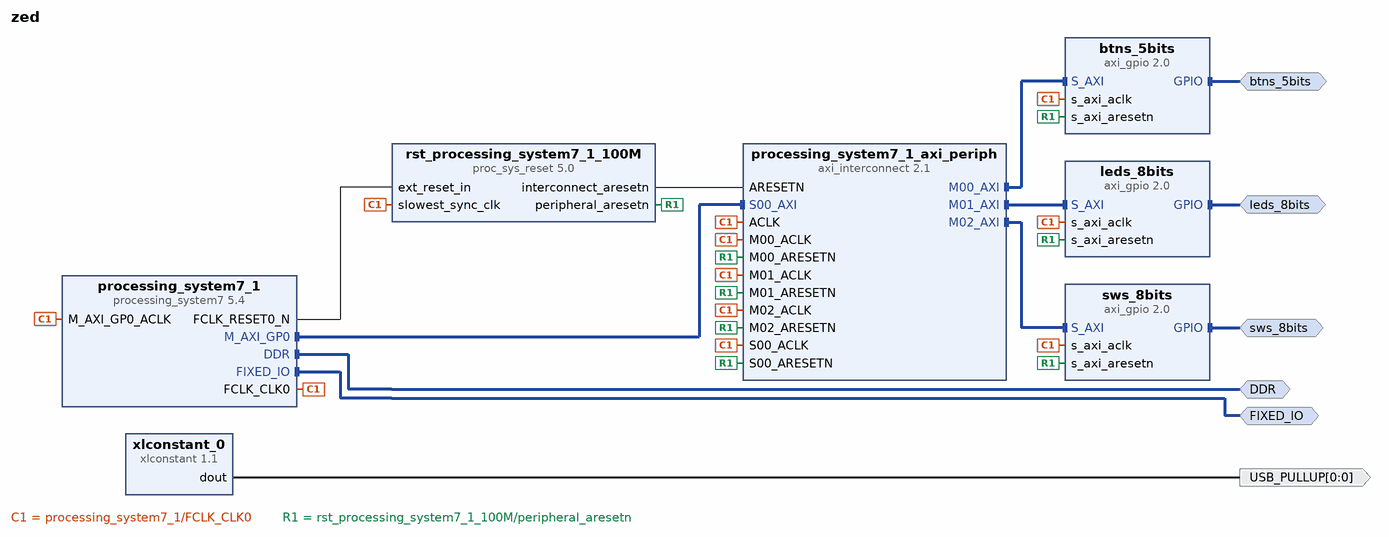
[diagram p0: block diagram of the top level]
# Vivado block design zed, Vivado 2014.2
create_bd_design zed

create_bd_intf_port -mode Master -vlnv xilinx.com:interface:ddrx_rtl:1.0 DDR
create_bd_intf_port -mode Master -vlnv xilinx.com:display_processing_system7:fixedio_rtl:1.0 FIXED_IO
create_bd_intf_port -mode Master -vlnv xilinx.com:interface:gpio_rtl:1.0 btns_5bits
create_bd_intf_port -mode Master -vlnv xilinx.com:interface:gpio_rtl:1.0 leds_8bits
create_bd_intf_port -mode Master -vlnv xilinx.com:interface:gpio_rtl:1.0 sws_8bits
create_bd_port -dir O -from 0 -to 0 USB_PULLUP

create_bd_cell -type ip -vlnv xilinx.com:ip:processing_system7:5.4 processing_system7_1
set_property -dict [list \
  CONFIG.PCW_QSPI_GRP_FBCLK_ENABLE 1 \
  CONFIG.PCW_TTC0_PERIPHERAL_ENABLE 1 \
  CONFIG.preset {ZedBoard*} \
] [get_bd_cells processing_system7_1]
# 1 more settings of processing_system7_1 are not shown: defaults, MIO pin electricals, DDR timing, and values the tool derives
create_bd_cell -type ip -vlnv xilinx.com:ip:axi_gpio:2.0 btns_5bits
set_property -dict [list \
  CONFIG.C_GPIO_WIDTH 5 \
  CONFIG.USE_BOARD_FLOW true \
  CONFIG.GPIO_BOARD_INTERFACE btns_5bits \
] [get_bd_cells btns_5bits]
create_bd_cell -type ip -vlnv xilinx.com:ip:axi_interconnect:2.1 processing_system7_1_axi_periph
set_property -dict {CONFIG.NUM_MI 3} [get_bd_cells processing_system7_1_axi_periph]
create_bd_cell -type ip -vlnv xilinx.com:ip:proc_sys_reset:5.0 rst_processing_system7_1_100M
create_bd_cell -type ip -vlnv xilinx.com:ip:axi_gpio:2.0 leds_8bits
set_property -dict [list \
  CONFIG.C_GPIO_WIDTH 8 \
  CONFIG.USE_BOARD_FLOW true \
  CONFIG.GPIO_BOARD_INTERFACE leds_8bits \
] [get_bd_cells leds_8bits]
create_bd_cell -type ip -vlnv xilinx.com:ip:axi_gpio:2.0 sws_8bits
set_property -dict [list \
  CONFIG.C_GPIO_WIDTH 8 \
  CONFIG.USE_BOARD_FLOW true \
  CONFIG.GPIO_BOARD_INTERFACE sws_8bits \
] [get_bd_cells sws_8bits]
create_bd_cell -type ip -vlnv xilinx.com:ip:xlconstant:1.1 xlconstant_0

# ---- connections ----

connect_bd_intf_net [get_bd_intf_pins processing_system7_1/M_AXI_GP0] [get_bd_intf_pins processing_system7_1_axi_periph/S00_AXI]
connect_bd_intf_net [get_bd_intf_pins processing_system7_1_axi_periph/M00_AXI] [get_bd_intf_pins btns_5bits/S_AXI]
connect_bd_intf_net [get_bd_intf_pins processing_system7_1_axi_periph/M01_AXI] [get_bd_intf_pins leds_8bits/S_AXI]
connect_bd_intf_net [get_bd_intf_pins processing_system7_1_axi_periph/M02_AXI] [get_bd_intf_pins sws_8bits/S_AXI]
connect_bd_intf_net [get_bd_intf_ports DDR] [get_bd_intf_pins processing_system7_1/DDR]
connect_bd_intf_net [get_bd_intf_ports FIXED_IO] [get_bd_intf_pins processing_system7_1/FIXED_IO]
connect_bd_intf_net [get_bd_intf_ports btns_5bits] [get_bd_intf_pins btns_5bits/GPIO]
connect_bd_intf_net [get_bd_intf_ports leds_8bits] [get_bd_intf_pins leds_8bits/GPIO]
connect_bd_intf_net [get_bd_intf_ports sws_8bits] [get_bd_intf_pins sws_8bits/GPIO]
connect_bd_net [get_bd_pins processing_system7_1/FCLK_CLK0] \
  [get_bd_pins processing_system7_1/M_AXI_GP0_ACLK] [get_bd_pins processing_system7_1_axi_periph/S00_ACLK] \
  [get_bd_pins rst_processing_system7_1_100M/slowest_sync_clk] [get_bd_pins processing_system7_1_axi_periph/ACLK] \
  [get_bd_pins btns_5bits/s_axi_aclk] [get_bd_pins processing_system7_1_axi_periph/M00_ACLK] \
  [get_bd_pins leds_8bits/s_axi_aclk] [get_bd_pins processing_system7_1_axi_periph/M01_ACLK] \
  [get_bd_pins sws_8bits/s_axi_aclk] [get_bd_pins processing_system7_1_axi_periph/M02_ACLK]
connect_bd_net [get_bd_pins processing_system7_1/FCLK_RESET0_N] [get_bd_pins rst_processing_system7_1_100M/ext_reset_in]
connect_bd_net [get_bd_pins rst_processing_system7_1_100M/peripheral_aresetn] \
  [get_bd_pins processing_system7_1_axi_periph/S00_ARESETN] [get_bd_pins btns_5bits/s_axi_aresetn] \
  [get_bd_pins processing_system7_1_axi_periph/M00_ARESETN] [get_bd_pins leds_8bits/s_axi_aresetn] \
  [get_bd_pins processing_system7_1_axi_periph/M01_ARESETN] [get_bd_pins sws_8bits/s_axi_aresetn] \
  [get_bd_pins processing_system7_1_axi_periph/M02_ARESETN]
connect_bd_net [get_bd_pins rst_processing_system7_1_100M/interconnect_aresetn] [get_bd_pins processing_system7_1_axi_periph/ARESETN]
connect_bd_net [get_bd_pins xlconstant_0/dout] [get_bd_ports USB_PULLUP]

# ---- address map ----
assign_bd_address -offset 0x41200000 -range 64K -target_address_space [get_bd_addr_spaces processing_system7_1/Data] [get_bd_addr_segs btns_5bits/S_AXI/Reg]
assign_bd_address -offset 0x41210000 -range 64K -target_address_space [get_bd_addr_spaces processing_system7_1/Data] [get_bd_addr_segs leds_8bits/S_AXI/Reg]
assign_bd_address -offset 0x41220000 -range 64K -target_address_space [get_bd_addr_spaces processing_system7_1/Data] [get_bd_addr_segs sws_8bits/S_AXI/Reg]

validate_bd_design
save_bd_design
